# Altium schematic sheet SCH_1_Controller.SchDoc
size A3
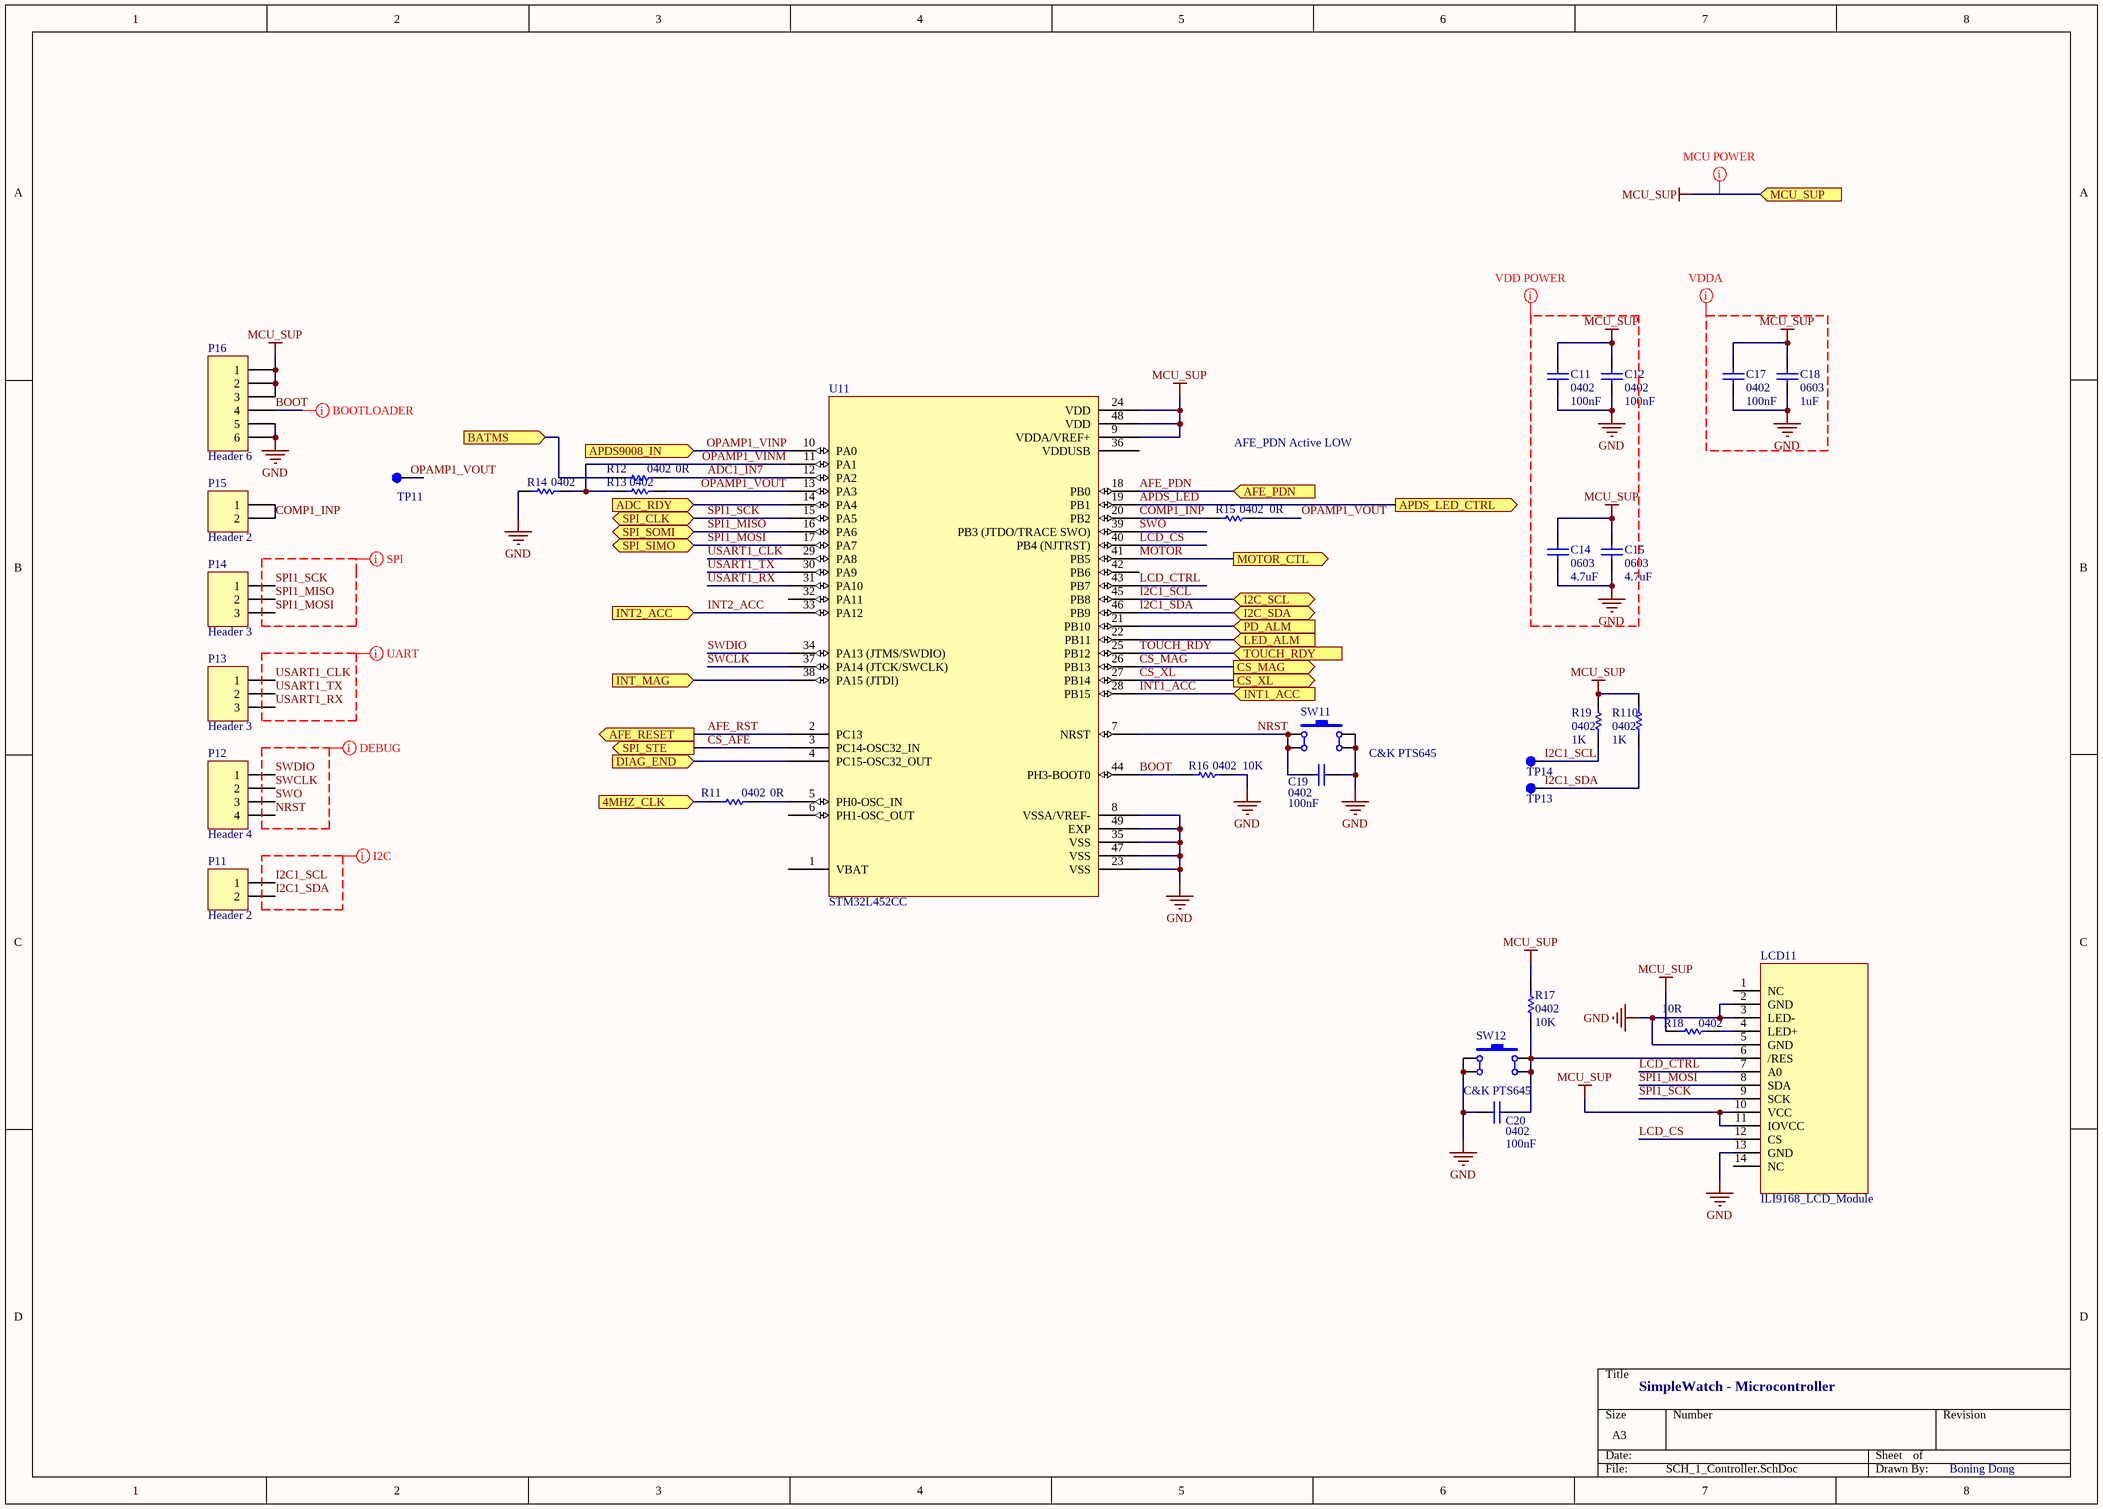
[diagram p0: SCH_1_Controller.SchDoc]

## Parts
C11  0402  value 100nF  [CAPC1005X06N]
C12  0402  value 100nF  [CAPC1005X06N]
C14  0603  value 4.7uF  [CAPC1608X09N]
C15  0603  value 4.7uF  [CAPC1608X09N]
C17  0402  value 100nF  [CAPC1005X06N]
C18  0603  value 1uF  [CAPC1608X09N]
C19  0402  value 100nF  [CAPC1005X06N]
C20  0402  value 100nF  [CAPC1005X06N]
LCD11  ILI9168_LCD_Module  [LCD_SMT_128X128]
P11  Header 2  [HDR1X2]
P12  Header 4  [HDR1X4]
P13  Header 3  [HDR1X3]
P14  Header 3  [HDR1X3]
P15  Header 2  [HDR1X2]
P16  Header 6  [HDR1X6]
R11  0402  value 0R  [RESC1005X04N]
R12  0402  value 0R  [RESC1005X04N]
R13  0402  [RESC1005X04N]
R14  0402  [RESC1005X04N]
R15  0402  value 0R  [RESC1005X04N]
R16  0402  value 10K  [RESC1005X04N]
R17  0402  value 10K  [RESC1005X04N]
R18  0402  value 10R  [RESC1005X04N]
R19  0402  value 1K  [RESC1005X04N]
R110  0402  value 1K  [RESC1005X04N]
SW11  C&K PTS645  [C&K_PTS645_SMT]
SW12  C&K PTS645  [C&K_PTS645_SMT]
TP11  TP  [TP100]  (value not drawn)
TP13  TP  [TP100]  (value not drawn)
TP14  TP  [TP100]  (value not drawn)
U11  STM32L452CC  [QFN50P700X700X60-48N_HS550X550]

## Ports
4MHZ_CLK (in), ADC_RDY (in), AFE_PDN (in), AFE_RESET (out), APDS9008_IN (in), APDS_LED_CTRL (out), BATMS (in), CS_MAG (out), CS_XL (out), DIAG_END (in), I2C_SCL (bidir), I2C_SDA (bidir), INT1_ACC (in), INT2_ACC (in), INT_MAG (in), LED_ALM (in), MCU_SUP (in), MOTOR_CTL (out), PD_ALM (in), SPI_CLK (bidir), SPI_SIMO (bidir), SPI_SOMI (bidir), SPI_STE (out), TOUCH_RDY (in)

## Nets
GND: C11.1 C12.1 C14.1 C15.1 C17.1 C18.1 C19.1 C20.2 LCD11.2(GND) LCD11.3(LED-) LCD11.5(GND) LCD11.13(GND) P16.5 P16.6 R14.1 R16.2 SW11.3 SW11.4 SW12.1 SW12.2 U11.8(VSSA/VREF-) U11.23(VSS) U11.35(VSS) U11.47(VSS) U11.49(EXP)
MCU_SUP: C11.2 C12.2 C14.2 C15.2 C17.2 C18.2 LCD11.10(VCC) LCD11.11(IOVCC) P16.1 P16.2 P16.3 R17.2 R18.2 R19.1 R110.1 U11.9(VDDA/VREF+) U11.24(VDD) U11.48(VDD) ; port MCU_SUP
4MHZ_CLK: R11.1 ; port 4MHZ_CLK
ADC1_IN7: R12.2 U11.12(PA2)
ADC_RDY: U11.14(PA4) ; port ADC_RDY
AFE_PDN: U11.18(PB0) ; port AFE_PDN
AFE_RST: U11.2(PC13) ; port AFE_RESET
APDS_LED: U11.19(PB1) ; port APDS_LED_CTRL
BATMS: R12.1 ; port BATMS
BOOT: P16.4 R16.1 U11.44(PH3-BOOT0)
COMP1_INP: P15.1 P15.2 R15.1 U11.20(PB2)
CS_AFE: U11.3(PC14-OSC32_IN) ; port SPI_STE
CS_MAG: U11.26(PB13) ; port CS_MAG
CS_XL: U11.27(PB14) ; port CS_XL
DIAG_END: U11.4(PC15-OSC32_OUT) ; port DIAG_END
I2C1_SCL: P11.1 R19.2 TP14.1 U11.45(PB8) ; port I2C_SCL
I2C1_SDA: P11.2 R110.2 TP13.1 U11.46(PB9) ; port I2C_SDA
INT1_ACC: U11.28(PB15) ; port INT1_ACC
INT2_ACC: U11.33(PA12) ; port INT2_ACC
INT_MAG: U11.38(PA15_(JTDI)) ; port INT_MAG
LCD_CS: LCD11.12(CS) U11.40(PB4_(NJTRST))
LCD_CTRL: LCD11.7(A0) U11.43(PB7)
LED_ALM: U11.22(PB11) ; port LED_ALM
MOTOR: U11.41(PB5) ; port MOTOR_CTL
NRST: C19.2 P12.4 SW11.1 SW11.2 U11.7(NRST)
OPAMP1_VINM: R13.1 R14.2 U11.11(PA1)
OPAMP1_VINP: U11.10(PA0) ; port APDS9008_IN
OPAMP1_VOUT: R13.2 R15.2 TP11.1 U11.13(PA3)
PD_ALM: U11.21(PB10) ; port PD_ALM
SPI1_MISO: P14.2 U11.16(PA6) ; port SPI_SOMI
SPI1_MOSI: LCD11.8(SDA) P14.3 U11.17(PA7) ; port SPI_SIMO
SPI1_SCK: LCD11.9(SCK) P14.1 U11.15(PA5) ; port SPI_CLK
SWCLK: P12.2 U11.37(PA14_(JTCK/SWCLK))
SWDIO: P12.1 U11.34(PA13_(JTMS/SWDIO))
SWO: P12.3 U11.39(PB3_(JTDO/TRACE_SWO))
TOUCH_RDY: U11.25(PB12) ; port TOUCH_RDY
USART1_CLK: P13.1 U11.29(PA8)
USART1_RX: P13.3 U11.31(PA10)
USART1_TX: P13.2 U11.30(PA9)
NetC20_1: C20.1 LCD11.6(/RES) R17.1 SW12.3 SW12.4
NetLCD11_4: LCD11.4(LED+) R18.1
NetR11_2: R11.2 U11.5(PH0-OSC_IN)

Not connected (* = marked no-connect by the designer): LCD11 1(NC) 14(NC); U11 1(VBAT) 6(PH1-OSC_OUT) 32(PA11) 36(VDDUSB) 42(PB6)

## Layout directives
net class SPI: SPI1_MISO, SPI1_MOSI, SPI1_SCK
net class UART: USART1_CLK, USART1_RX, USART1_TX
net class MCU_DEBUG: NRST, SWCLK, SWDIO, SWO
net class I2C: I2C1_SCL, I2C1_SDA
net class BOOTLOADER: BOOT
net class MCU_POWER: MCU_SUP
net class VDD_POWER: GND, MCU_SUP
mark named VDDA: GND, MCU_SUP

## Notes on the sheet
- AFE_PDN Active LOW
- SimpleWatch - Microcontroller
- Boning Dong

## Library data of the parts
C11 C12 C14 C15 C17-C20 = Cap: Capacitor; Published: 8-Jun-2000; LatestRevisionDate: 17-Jul-2002; LatestRevisionNote: Re-released for DXP Platform.; PackageReference: RAD-0.3; Publisher: Altium Limited; PackageDescription: Radial Cap, Thru-Hole; 2 Leads; 0.3 in Pin Spacing
P11 P15 = Header 2: Header, 2-Pin; LatestRevisionDate: 17-Jul-2002; LatestRevisionNote: Re-released for DXP Platform.; Publisher: Altium Limited
P12 = Header 4: Header, 4-Pin; LatestRevisionDate: 17-Jul-2002; LatestRevisionNote: Re-released for DXP Platform.; Publisher: Altium Limited
P13 P14 = Header 3: Header, 3-Pin; LatestRevisionDate: 17-Jul-2002; LatestRevisionNote: Re-released for DXP Platform.; Publisher: Altium Limited
P16 = Header 6: Header, 6-Pin; LatestRevisionDate: 17-Jul-2002; LatestRevisionNote: Re-released for DXP Platform.; Publisher: Altium Limited
R11 R12 R15-R19 R110 = Res1: Resistor; Published: 8-Jun-2000; LatestRevisionDate: 17-Jul-2002; LatestRevisionNote: Re-released for DXP Platform.; PackageReference: AXIAL-0.3; Publisher: Altium Limited; PackageDescription: Axial Device, Thru-Hole; 2 Leads; 0.3 in Pin Spacing
R13 R14 = Res1: Resistor; Value: ?R; Published: 8-Jun-2000; LatestRevisionDate: 17-Jul-2002; LatestRevisionNote: Re-released for DXP Platform.; PackageReference: AXIAL-0.3; Publisher: Altium Limited; PackageDescription: Axial Device, Thru-Hole; 2 Leads; 0.3 in Pin Spacing
SW11 SW12 = SW_TACT: General Tactile Switch
TP11 TP13 TP14 = TP_A: Test Point dot type
U11 = STM32L452CX: ARM® Cortex®-M4 STM32L4 Microcontroller IC 32-Bit 80MHz 512KB (512K x 8) FLASH 48-UFQFPN (7x7)